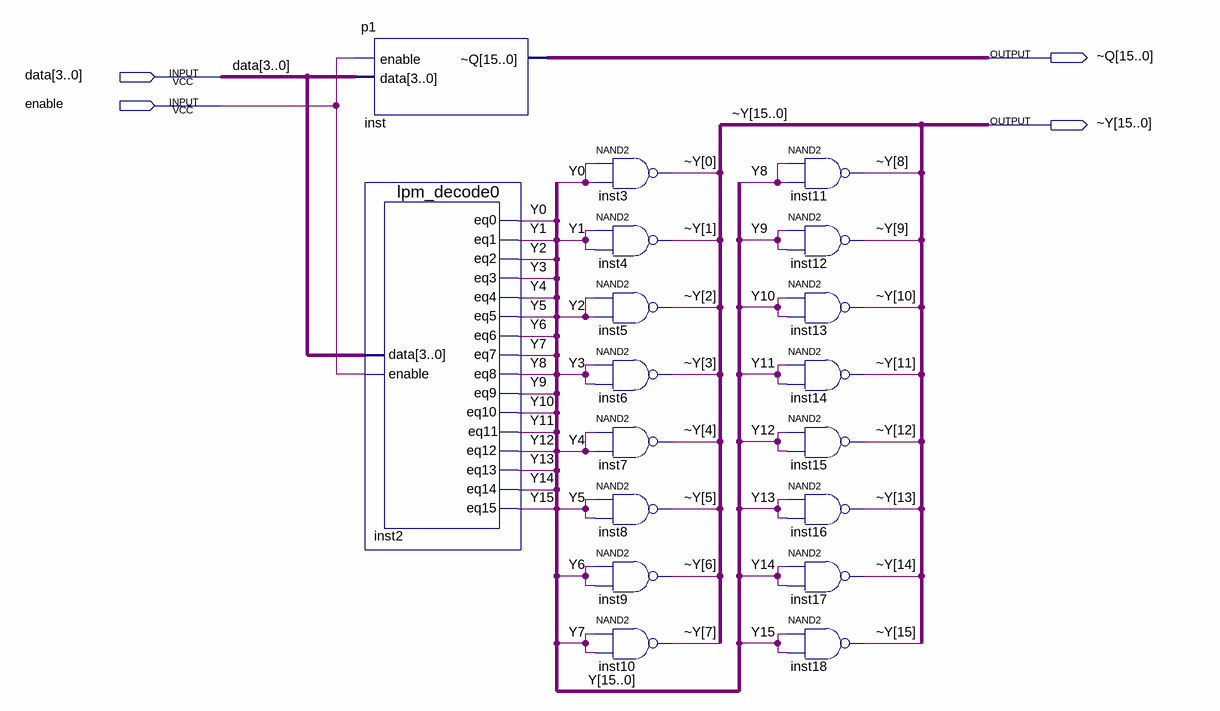
[diagram p0: schematic sheet]
// Quartus schematic p2.bdf as structural Verilog: 18 symbols, 4 pins
module p2 (
  input  [3:0] data,
  input  enable,
  output [15:0] \~Q ,
  output [15:0] \~Y 
);

  wire [15:0] Y;

  p1 inst (.enable(enable), .data(data), .\~Q (\~Q ));
  lpm_decode0 inst2 (
    .data(data), .enable(enable), .eq0(Y[0]), .eq1(Y[1]), .eq2(Y[2]), .eq3(Y[3]), .eq4(Y[4]), .eq5(Y[5]),
    .eq6(Y[6]), .eq7(Y[7]), .eq8(Y[8]), .eq9(Y[9]), .eq10(Y[10]), .eq11(Y[11]), .eq12(Y[12]), .eq13(Y[13]),
    .eq14(Y[14]), .eq15(Y[15]));
  nand inst3 (\~Y [0], Y[0], Y[0]);
  nand inst4 (\~Y [1], Y[1], Y[1]);
  nand inst5 (\~Y [2], Y[2], Y[2]);
  nand inst6 (\~Y [3], Y[3], Y[3]);
  nand inst7 (\~Y [4], Y[4], Y[4]);
  nand inst8 (\~Y [5], Y[5], Y[5]);
  nand inst9 (\~Y [6], Y[6], Y[6]);
  nand inst10 (\~Y [7], Y[7], Y[7]);
  nand inst11 (\~Y [8], Y[8], Y[8]);
  nand inst12 (\~Y [9], Y[9], Y[9]);
  nand inst13 (\~Y [10], Y[10], Y[10]);
  nand inst14 (\~Y [11], Y[11], Y[11]);
  nand inst15 (\~Y [12], Y[12], Y[12]);
  nand inst16 (\~Y [13], Y[13], Y[13]);
  nand inst17 (\~Y [14], Y[14], Y[14]);
  nand inst18 (\~Y [15], Y[15], Y[15]);
endmodule
